# EAGLE schematic sch_smd_1206_component_only_component (EAGLE 8.4.1)
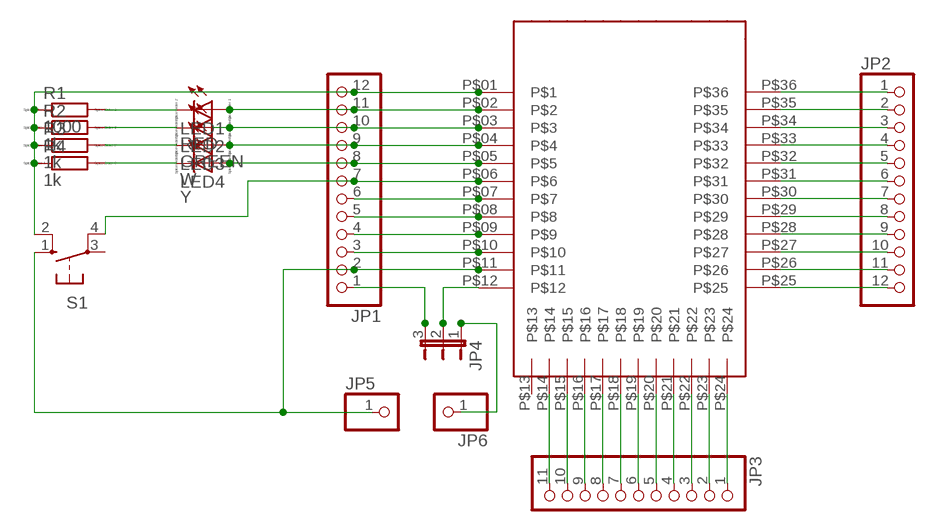
[diagram p0: schematic, sheet 1]

## Parts
JP1  PINHD-1X12  [1X12]
JP2  PINHD-1X12  [1X12]
JP3  PINHD-1X11  [1X11]
JP4  JP2E  [JP2]
JP5  PINHD-1X1  [1X01]
JP6  PINHD-1X1  [1X01]
LED1  RED  LED_E  [LED_1206]
LED2  GREEN  LED_E  [LED_1206]
LED3  W  LED_E  [LED_1206]
LED4  Y  LED_E  [LED_1206]
R1  1000  RR1206  [R1206]
R2  1k  RR1206  [R1206]
R3  1k  RR1206  [R1206]
R4  1k  RR1206  [R1206]
S1  10-XX  [B3F-10XX]
U$1  HZX_MODULE  [SMD_PAD_VERSION]

## Nets
N$1: JP4.2 U$1.P$12
N$3: JP1.3 U$1.P$10
N$4: JP1.4 U$1.P$09
N$5: JP1.5 U$1.P$08
N$6: JP1.6 U$1.P$07
N$7: JP1.7 S1.4(P1) U$1.P$06
N$8: JP1.8 LED4.A U$1.P$05
N$9: JP1.9 LED3.A U$1.P$04
N$10: JP1.10 LED2.A U$1.P$03
N$11: JP1.11 LED1.A U$1.P$02
N$12: JP1.1 JP4.3
N$13: JP2.1 U$1.P$36
N$14: JP2.2 U$1.P$35
N$15: JP2.3 U$1.P$34
N$16: JP2.4 U$1.P$33
N$17: JP2.5 U$1.P$32
N$18: JP2.6 U$1.P$31
N$19: JP2.7 U$1.P$30
N$20: JP2.8 U$1.P$29
N$21: JP2.9 U$1.P$28
N$22: JP2.10 U$1.P$27
N$23: JP2.11 U$1.P$26
N$24: JP2.12 U$1.P$25
N$25: JP3.1 U$1.P$24
N$26: JP3.2 U$1.P$23
N$27: JP3.3 U$1.P$22
N$28: JP3.4 U$1.P$21
N$29: JP3.5 U$1.P$20
N$30: JP3.6 U$1.P$19
N$31: JP3.7 U$1.P$18
N$32: JP3.8 U$1.P$17
N$33: JP3.9 U$1.P$16
N$34: JP3.10 U$1.P$15
N$35: JP3.11 U$1.P$14
N$37: JP1.2 JP5.1 S1.1(S) U$1.P$11
N$38: JP4.1 JP6.1
N$39: LED1.C R1.2
N$40: LED2.C R2.2
N$41: LED3.C R3.2
N$42: LED4.C R4.2
N$44: JP1.12 R1.1 R2.1 R3.1 R4.1 S1.2(S1) U$1.P$01
Unconnected: S1.3(P) U$1.P$13

## Library data of the parts
JP1 = pinhead:PINHD-1X12: PIN HEADER; SPICEPREFIX: X
JP2 = pinhead:PINHD-1X12: PIN HEADER
JP3 = pinhead:PINHD-1X11: PIN HEADER
JP4 = jumper:JP2E: JUMPER
JP5 JP6 = pinhead:PINHD-1X1: PIN HEADER
LED1-LED4 = eagle-ltspice:LED_E: LED Source: http://www.osram.convergy.de Source: www.luxeon.com Source: www.kingbright.com; SPICEMODEL: NONE; SPICEPREFIX: D; SPICETYPE: diode
R1-R4 = eagle-ltspice:R: RESISTOR, European symbol; SPICEMODEL: NONE; SPICEPREFIX: R
S1 = switch-omron:10-XX: OMRON SWITCH; MPN: B3F-1000; OC_FARNELL: 176432; OC_NEWARK: 36M3542
U$1 = HZX_MODULE:HZX_MODULE; AUTHOR: Agam